# EAGLE design Arduio_matrix-shield_02 (EAGLE 6.6.0)
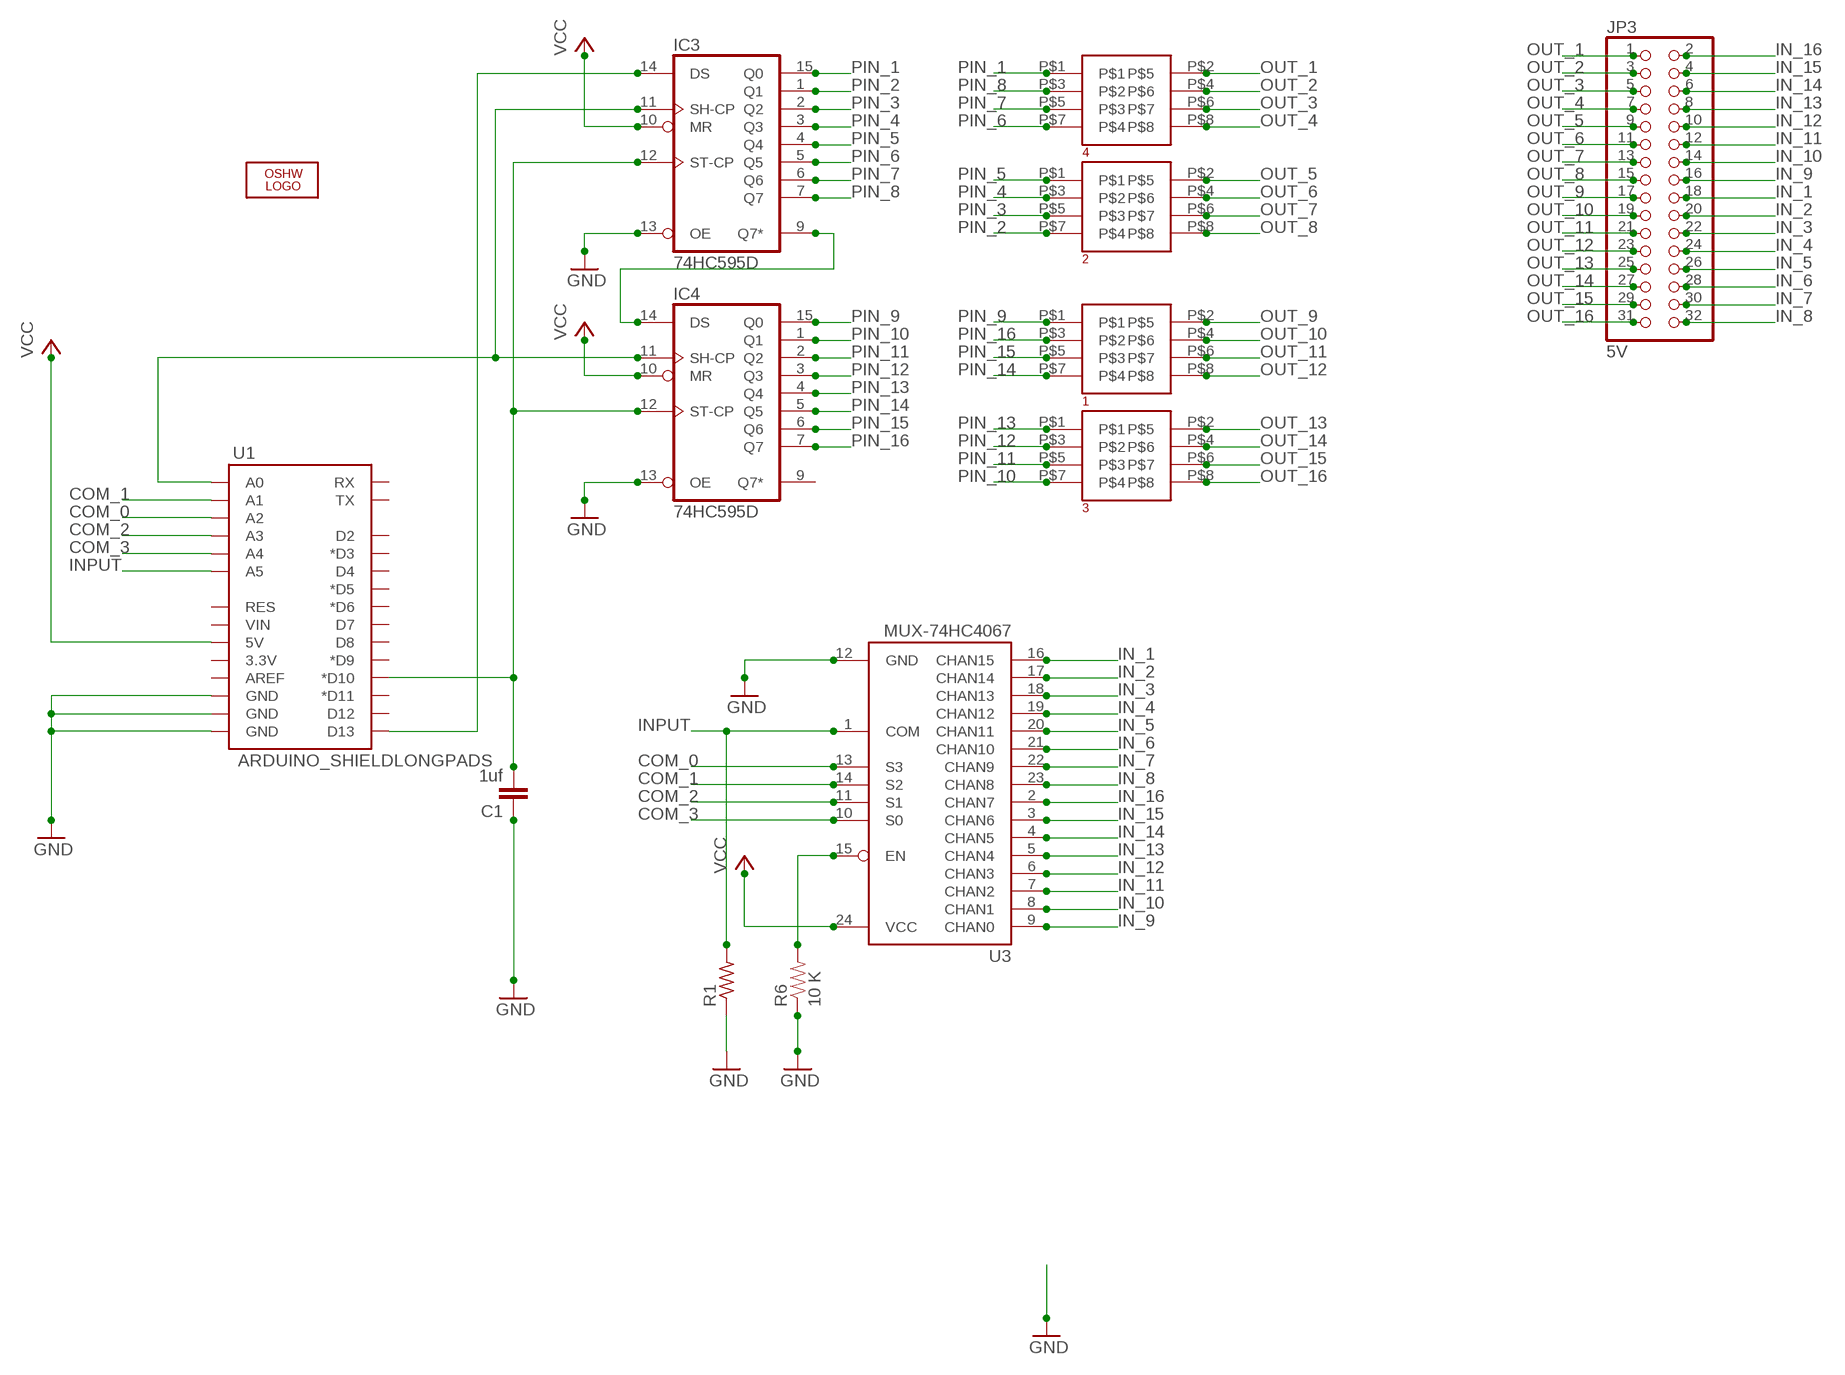
[diagram p0: schematic, sheet 1]

## Parts
1  D83A  [D83A]
2  D83A  [D83A]
3  D83A  [D83A]
4  D83A  [D83A]
C1  1uf  2.2UF-CERCAP-10009  [1206]
IC3  74HC595D  [SO16]
IC4  74HC595D  [SO16]
JP3  5V  PINHD-2X16/90  [2X16/90]
OSHW  OSHW_LOGO_8MILX0350-NT  [OSHW_8X350_NOTEXT]
R1  R-US_0204/7  [0204/7]
R6  10 K  RESISTOR1206  [1206]
U1  ARDUINO_SHIELDLONGPADS  [DUEMILANOVE_SHIELD_LONGPADS]
U3  MUX-74HC4067  MUX-74HC4067SMD  [SSOP24]

## Nets
COM_0: U1.A2 U3.13(S3)
COM_1: U1.A1 U3.14(S2)
COM_2: U1.A3 U3.11(S1)
COM_3: U1.A4 U3.10(S0)
GND [gnd_plane]: C1.1 IC3.13(OE) IC4.13(OE) R1.1 R6.1 U1.GND@0(GND) U1.GND@1(GND) U1.GND@2(GND) U3.12(GND)
IN_1: JP3.18 U3.16(CHAN15)
IN_2: JP3.20 U3.17(CHAN14)
IN_3: JP3.22 U3.18(CHAN13)
IN_4: JP3.24 U3.19(CHAN12)
IN_5: JP3.26 U3.20(CHAN11)
IN_6: JP3.28 U3.21(CHAN10)
IN_7: JP3.30 U3.22(CHAN9)
IN_8: JP3.32 U3.23(CHAN8)
IN_9: JP3.16 U3.9(CHAN0)
IN_10: JP3.14 U3.8(CHAN1)
IN_11: JP3.12 U3.7(CHAN2)
IN_12: JP3.10 U3.6(CHAN3)
IN_13: JP3.8 U3.5(CHAN4)
IN_14: JP3.6 U3.4(CHAN5)
IN_15: JP3.4 U3.3(CHAN6)
IN_16: JP3.2 U3.2(CHAN7)
INPUT: R1.2 U1.A5 U3.1(COM)
N$1: IC3.9(Q7*) IC4.14(DS)
N$2: R6.2 U3.15(EN)
N$3: IC3.11(SH-CP) IC4.11(SH-CP) U1.A0
N$4: C1.2 IC3.12(ST-CP) IC4.12(ST-CP) U1.D10(*D10)
N$8: IC3.14(DS) U1.D13
OUT_1: 4.P$2 JP3.1
OUT_2: 4.P$4 JP3.3
OUT_3: 4.P$6 JP3.5
OUT_4: 4.P$8 JP3.7
OUT_5: 2.P$2 JP3.9
OUT_6: 2.P$4 JP3.11
OUT_7: 2.P$6 JP3.13
OUT_8: 2.P$8 JP3.15
OUT_9: 1.P$2 JP3.17
OUT_10: 1.P$4 JP3.19
OUT_11: 1.P$6 JP3.21
OUT_12: 1.P$8 JP3.23
OUT_13: 3.P$2 JP3.25
OUT_14: 3.P$4 JP3.27
OUT_15: 3.P$6 JP3.29
OUT_16: 3.P$8 JP3.31
PIN_1: 4.P$1 IC3.15(Q0)
PIN_2: 2.P$7 IC3.1(Q1)
PIN_3: 2.P$5 IC3.2(Q2)
PIN_4: 2.P$3 IC3.3(Q3)
PIN_5: 2.P$1 IC3.4(Q4)
PIN_6: 4.P$7 IC3.5(Q5)
PIN_7: 4.P$5 IC3.6(Q6)
PIN_8: 4.P$3 IC3.7(Q7)
PIN_9: 1.P$1 IC4.15(Q0)
PIN_10: 3.P$7 IC4.1(Q1)
PIN_11: 3.P$5 IC4.2(Q2)
PIN_12: 3.P$3 IC4.3(Q3)
PIN_13: 3.P$1 IC4.4(Q4)
PIN_14: 1.P$7 IC4.5(Q5)
PIN_15: 1.P$5 IC4.6(Q6)
PIN_16: 1.P$3 IC4.7(Q7)
VCC: IC3.10(MR) IC4.10(MR) U1.5V U3.24(VCC)
Unconnected: IC4.9(Q7*) U1.3.3V U1.AREF U1.D2 U1.D3(*D3) U1.D4 U1.D5(*D5) U1.D6(*D6) U1.D7 U1.D8 U1.D9(*D9) U1.D11(*D11) U1.D12 U1.RES U1.RX U1.TX U1.VIN

## Power pins joined to a net without a drawn wire
GND: IC3.8(GND) IC4.8(GND)
VCC: IC3.16(VCC) IC4.16(VCC)

## Library data of the parts
1-4 = diodes_array:D83A
C1 = SparkFun-Capacitors:2.2UF-CER: 2.2uF Ceramic SMT CAP-07888- 10V, 20% (0603) CAP-10009- 50V, 10% (1206); PROD_ID: CAP-10009; VALUE: 2.2uF
IC3 IC4 = 74xx-eu:74*595: 8-bit SHIFT REGISTER, output latch
JP3 = pinhead:PINHD-2X16: PIN HEADER
OSHW = ohw-logo:OSHW_LOGO_8MIL
R1 = rcl:R-US_: RESISTOR, American symbol
R6 = spark-fun:RESISTOR: Resistor Basic schematic elements and footprints for 0603, 1206, and PTH 1/10th watt (small) resistors.
U1 = SparkFun-Boards:ARDUINO_SHIELD: Arduino shield footprint
U3 = SparkFun:MUX-74HC4067

## Net classes
0 default: width 0.24 mm, drill 0.8 mm, clearance 0.432 mm
2 gnd_plane: width 1 mm, drill 0.8 mm, clearance 0.356 mm
3 vcc: width 1 mm, drill 0.8 mm, clearance 0.356 mm
4 VDD: width 1 mm, clearance 0.381 mm

## Board
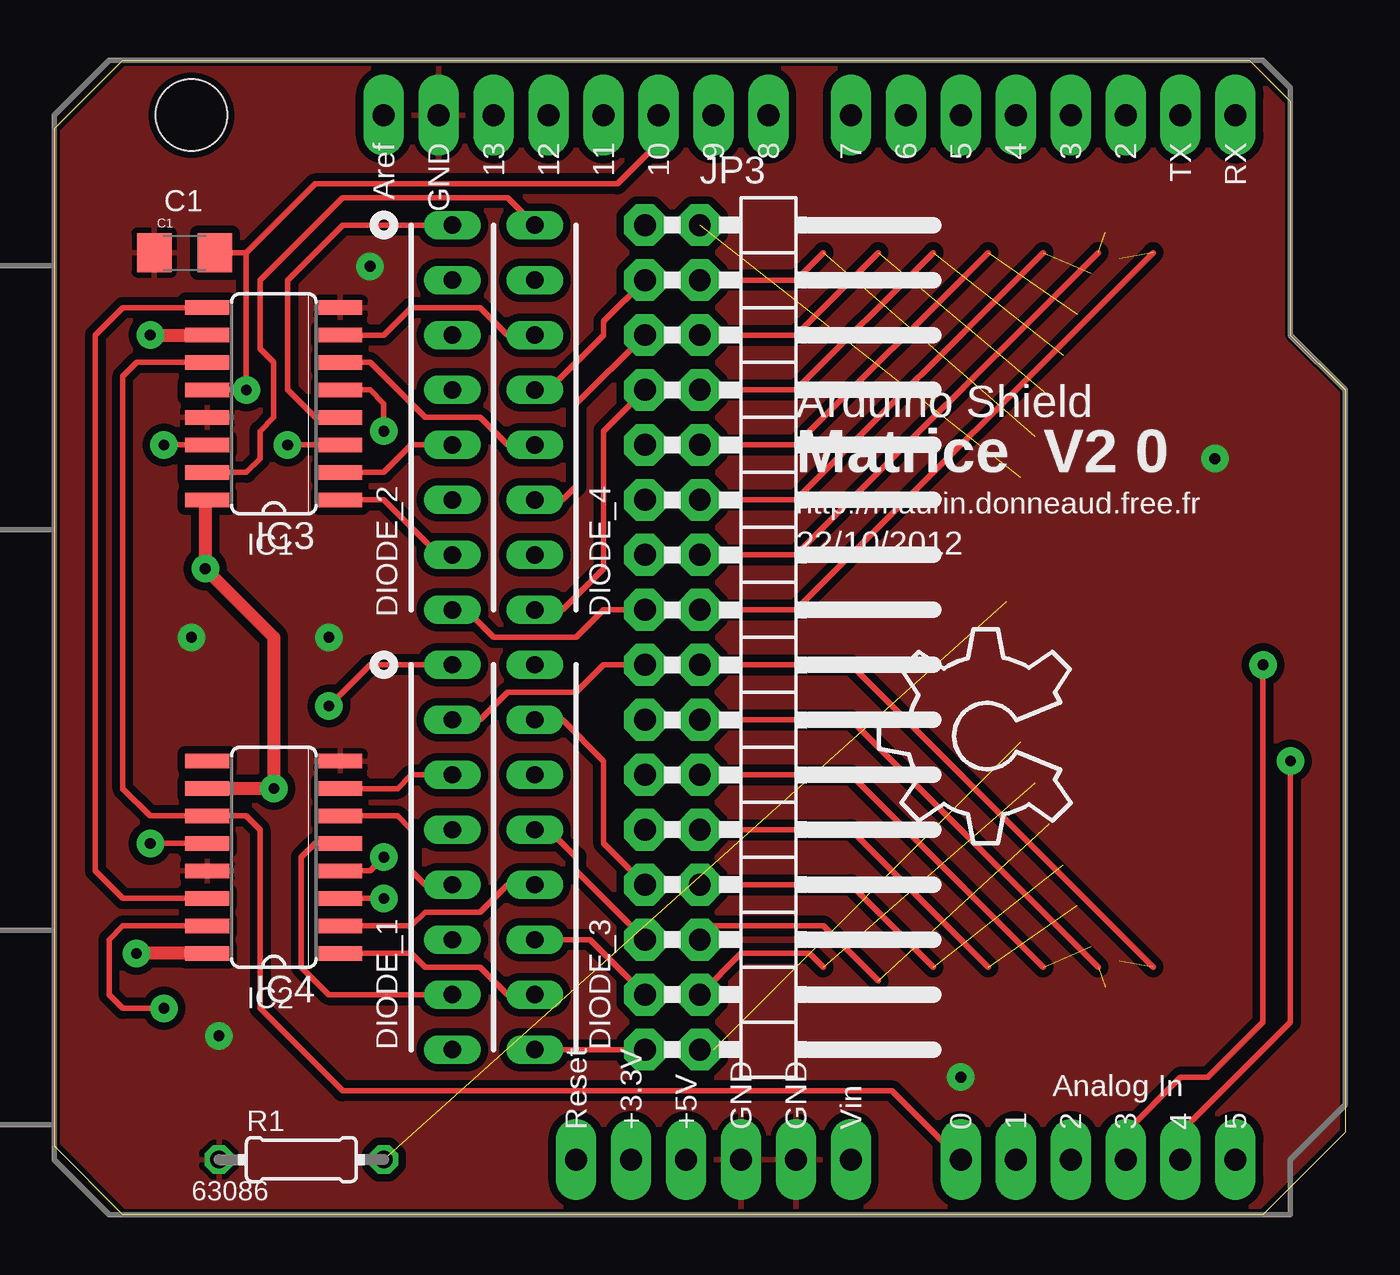
[diagram p1: board, top side]
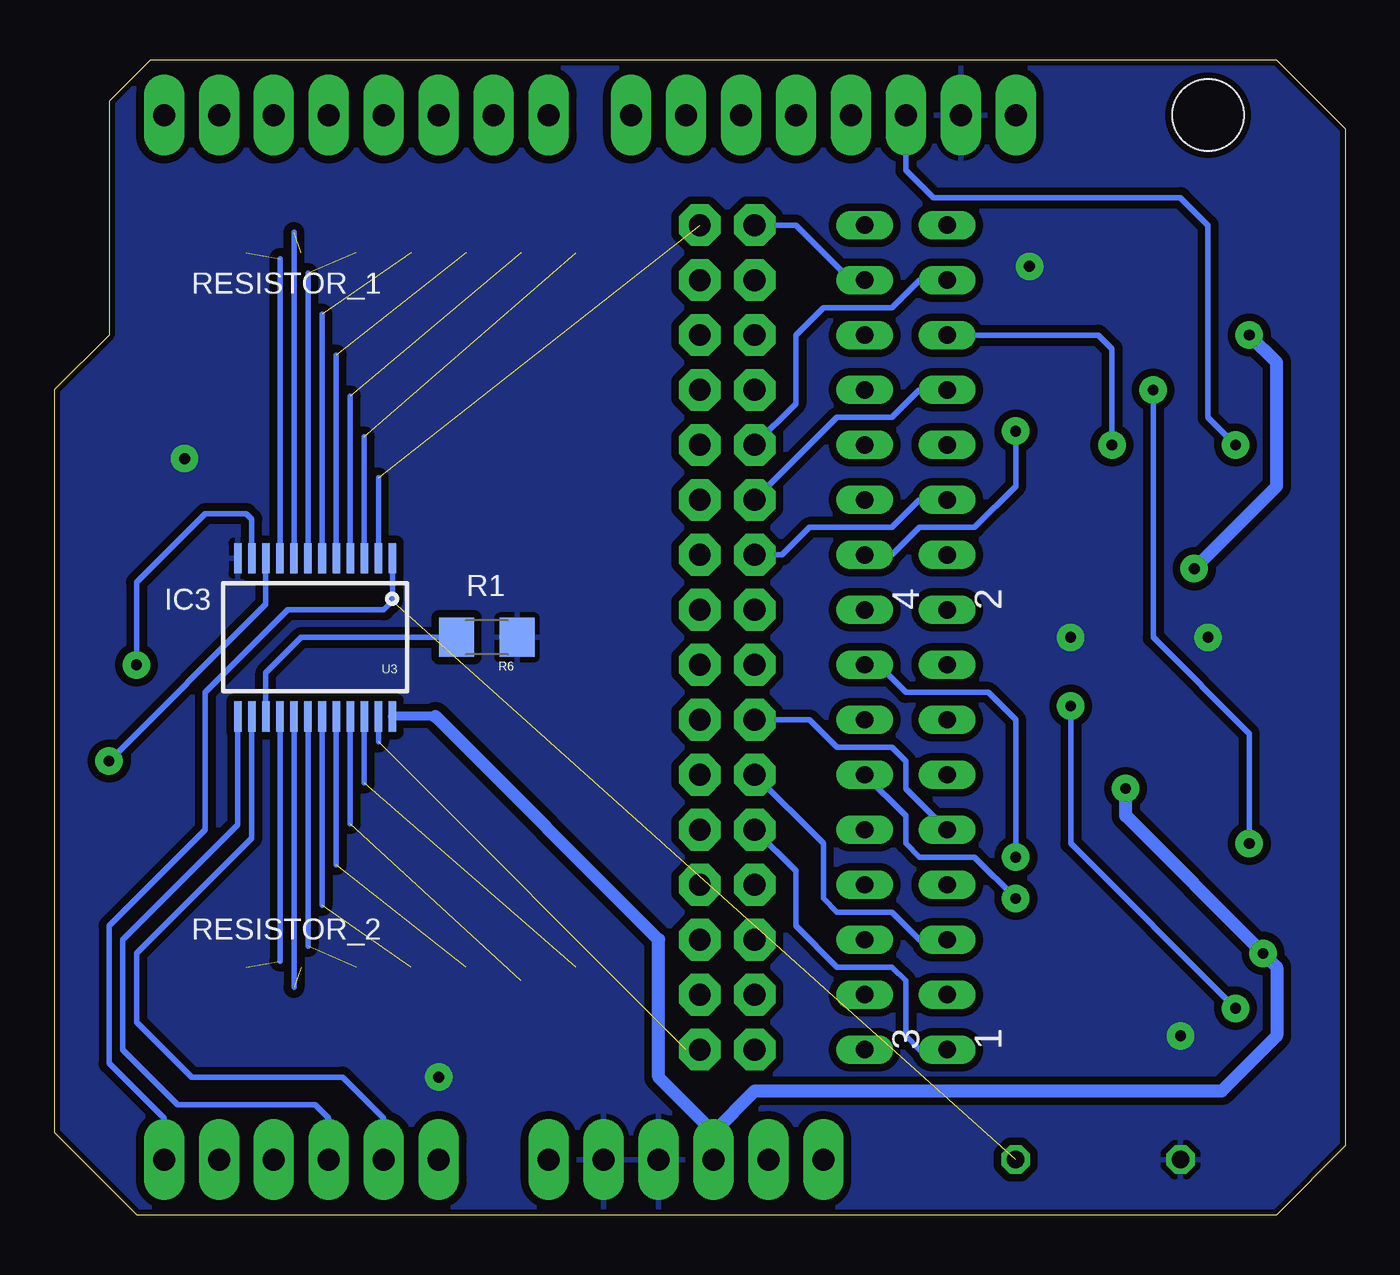
[diagram p2: board, bottom side, seen from below]

Size 59.69 x 53.34 mm. Coordinates in mm from the lower left corner, seen from the top.
Outline: 0,50.16 0,3.17 3.17,0 55.88,0 59.69,3.81 59.69,38.1 57.15,40.64 57.15,51.44 55.24,53.34 3.17,53.34 0,50.16
Copper layers (1*16): Top 0.035mm / dielectric 1.5mm / Bottom 0.035mm
Design rules "default": minimum track width 6mil, minimum drill 12mil, track to track 6mil, track to pad 6mil, pad to pad 6mil, via to via 6mil, smd to smd 0mil, copper to edge 10mil, drill to drill 10mil, minimum pad ring 10mil, minimum via ring 6mil, stop-mask expansion 2mil, vias tented up to drill 100mil, thermal gap 10mil

### Footprints (pad centres in the part's own frame; a part is rotated, then mirrored left to right if it is on the bottom)
D83A = drill 0.8 long: P$1 0,5.08; P$2 0,2.54; P$3 0,0; P$4 0,-2.54; P$5 0,-5.08; P$6 0,-7.62; P$7 0,-10.16; P$8 0,-12.7
1206 = smd 1.6 x 1.8: 1 -1.4,0; 2 1.4,0
SO16 = smd 0.66 x 2.032: 1 -4.445,-3.073; 2 -3.175,-3.073; 3 -1.905,-3.073; 4 -0.635,-3.073; 5 0.635,-3.073; 6 1.905,-3.073; 7 3.175,-3.073; 8 4.445,-3.073; 9 4.445,3.073; 10 3.175,3.073; 11 1.905,3.073; 12 0.635,3.073; 13 -0.635,3.073; 14 -1.905,3.073; 15 -3.175,3.073; 16 -4.445,3.073
2X16/90 = drill 1.016 pad 1.93 octagon: 1 -19.05,-6.35; 2 -19.05,-3.81; 3 -16.51,-6.35; 4 -16.51,-3.81; 5 -13.97,-6.35; 6 -13.97,-3.81; 7 -11.43,-6.35; 8 -11.43,-3.81; 9 -8.89,-6.35; 10 -8.89,-3.81; 11 -6.35,-6.35; 12 -6.35,-3.81; 13 -3.81,-6.35; 14 -3.81,-3.81; 15 -1.27,-6.35; 16 -1.27,-3.81; 17 1.27,-6.35; 18 1.27,-3.81; 19 3.81,-6.35; 20 3.81,-3.81; 21 6.35,-6.35; 22 6.35,-3.81; 23 8.89,-6.35; 24 8.89,-3.81; 25 11.43,-6.35; 26 11.43,-3.81; 27 13.97,-6.35; 28 13.97,-3.81; 29 16.51,-6.35; 30 16.51,-3.81; 31 19.05,-6.35; 32 19.05,-3.81
0204/7 = drill 0.813 octagon: 1 -3.81,0; 2 3.81,0
DUEMILANOVE_SHIELD_LONGPADS = drill 1.016 pad 1.88 long: 3.3V 50.8,26.67; 5V 50.8,29.21; A0 50.8,41.91; A1 50.8,44.45; A2 50.8,46.99; A3 50.8,49.53; A4 50.8,52.07; A5 50.8,54.61; AREF 2.54,15.24; D2 2.54,49.53; D3 2.54,46.99; D4 2.54,44.45; D5 2.54,41.91; D6 2.54,39.37; D7 2.54,36.83; D8 2.54,33.02; D9 2.54,30.48; D10 2.54,27.94; D11 2.54,25.4; D12 2.54,22.86; D13 2.54,20.32; GND@0 50.8,31.75; GND@1 50.8,34.29; GND@2 2.54,17.78; RES 50.8,24.13; RX 2.54,54.61; TX 2.54,52.07; VIN 50.8,36.83 | hole 3.302: 2.54,6.35
SSOP24 = smd 0.348 x 1.397: 1 -3.575,-3.656; 2 -2.925,-3.656; 3 -2.275,-3.656; 4 -1.625,-3.656; 5 -0.975,-3.656; 6 -0.325,-3.656; 7 0.325,-3.656; 8 0.975,-3.656; 9 1.625,-3.656; 10 2.275,-3.656; 11 2.925,-3.656; 12 3.575,-3.656; 13 3.575,3.656; 14 2.925,3.656; 15 2.275,3.656; 16 1.625,3.656; 17 0.975,3.656; 18 0.325,3.656; 19 -0.325,3.656; 20 -0.975,3.656; 21 -1.625,3.656; 22 -2.275,3.656; 23 -2.925,3.656; 24 -3.575,3.656

### Placement (x,y rotation side)
1  18.41,20.32 0 bottom
2  18.41,40.64 0 bottom
3  22.23,20.32 0 bottom
4  22.23,40.64 0 bottom
C1  6.03,44.45 0 top
IC3  10.16,37.47 90 top
IC4  10.16,16.51 90 top
JP3  33.66,26.67 270 top
OSHW  46.99,17.14 90 top
R1  11.43,2.54 0 top
R6  39.69,26.67 180 bottom
U1  0,53.34 270 top
U3  47.62,26.67 180 bottom

### Tracks (layer width: path | path; a pad name or v marks a point on that pad's centre or on a via)
COM_0
  Bottom 0.254: U3.13 51.2,18.02 56.52,12.7 56.52,7.62 53.98,5.08 47.62,5.08 46.99,4.45 U1.A2
COM_1
  Bottom 0.254: U3.14 50.55,17.39 55.88,12.06 55.88,8.89 53.34,6.35 46.35,6.35 44.45,4.45 U1.A1
COM_2  (via drill 0.5 pad 1.27)
  Top 0.254: v55.88,25.4 55.88,8.89 53.34,6.35 52.07,6.35 49.53,3.81 U1.A3
  Bottom 0.254: U3.11 50.55,32.13 50.8,32.38 52.7,32.38 55.88,29.21 v55.88,25.4
COM_3  (via drill 0.5 pad 1.27)
  Top 0.254: v57.15,20.95 57.15,8.89 52.07,3.81 U1.A4
  Bottom 0.254: U3.10 49.9,28.2 v57.15,20.95
GND  (via drill 0.5 pad 1.27)
  other vias: 14.61,43.81 12.7,26.67 6.35,26.67 7.62,8.26 53.66,34.92 41.91,6.35
  pour Bottom: 55.24,53.34 3.17,53.34 0,50.16 0,3.17 3.17,0 55.88,0 59.69,3.81 59.69,38.1 57.15,40.64 57.15,51.44
  pour Top: 0,50.16 0,3.17 3.17,0 55.88,0 59.69,3.81 59.69,38.1 57.15,40.64 57.15,51.44 55.24,53.34 3.17,53.34
IN_1  (1 unrouted)
  Top 0.254: JP3.18 36.83,25.4 50.8,11.43
  Bottom 0.254: U3.16 49.25,11.71
IN_2  (1 unrouted)
  Top 0.254: JP3.20 36.83,22.86 48.26,11.43
  Bottom 0.254: U3.17 48.6,10.5
IN_3  (1 unrouted)
  Top 0.254: JP3.22 36.83,20.32 45.72,11.43
  Bottom 0.254: U3.18 47.95,12.39
IN_4  (1 unrouted)
  Top 0.254: JP3.24 36.83,17.78 43.18,11.43
  Bottom 0.254: U3.19 47.3,14.28
IN_5  (1 unrouted)
  Top 0.254: JP3.26 36.83,15.24 40.64,11.43
  Bottom 0.254: U3.20 46.65,16.17
IN_6  (1 unrouted)
  Top 0.254: JP3.28 30.48,13.34 35.56,13.34 38.1,10.79
  Bottom 0.254: U3.21 46,18.06
IN_7  (1 unrouted)
  Top 0.254: JP3.30 31.75,12.06 34.92,12.06 35.56,11.43
  Bottom 0.254: U3.22 45.35,19.95
IN_8  (1 unrouted)
  Top 0.254: JP3.32 30.48,7.62
  Bottom 0.254: U3.23 44.7,21.84
IN_9  (1 unrouted)
  Top 0.254: JP3.16 34.29,27.94 50.8,44.45
  Bottom 0.254: U3.9 49.25,44.17
IN_10  (1 unrouted)
  Top 0.254: JP3.14 34.29,30.48 48.26,44.45
  Bottom 0.254: U3.8 48.6,45.38
IN_11  (1 unrouted)
  Top 0.254: JP3.12 34.29,33.02 45.72,44.45
  Bottom 0.254: U3.7 47.95,43.49
IN_12  (1 unrouted)
  Top 0.254: JP3.10 34.29,35.56 43.18,44.45
  Bottom 0.254: U3.6 47.3,41.6
IN_13  (1 unrouted)
  Top 0.254: JP3.8 34.29,38.1 40.64,44.45
  Bottom 0.254: U3.5 46.65,39.71
IN_14  (1 unrouted)
  Top 0.254: JP3.6 34.29,40.64 38.1,44.45
  Bottom 0.254: U3.4 46,37.82
IN_15  (1 unrouted)
  Top 0.254: 35.56,44.45 34.29,43.18 JP3.4
  Bottom 0.254: U3.3 45.35,35.93
IN_16  (1 unrouted)
  Bottom 0.254: U3.2 44.7,34.04
INPUT  (1 unrouted)
  Bottom 0.254: U3.1 44.05,28.34 44.45,27.94 48.9,27.94 52.7,24.13 52.7,17.78 57.15,13.34 57.15,6.99 54.61,4.45 U1.A5
N$1
  Top 0.254: IC3.9 3.17,41.91 1.91,40.64 1.91,15.88 3.17,14.61 IC4.14
N$2
  Bottom 0.254: U3.15 49.9,25.03 48.26,26.67 R6.2
N$3
  Top 0.254: IC3.11 3.81,39.37 3.17,38.73 3.17,19.68 4.45,18.41 IC4.11 8.89,18.41 9.53,17.78 9.53,9.53 13.34,5.71 38.73,5.71 U1.A0
N$4  (via drill 0.5 pad 1.27)
  Top 0.254: U1.D10 27.94,49.53 26.04,47.62 12.06,47.62 8.89,44.45 | IC3.12 v8.89,38.1 8.89,44.45 | C1.2 8.89,44.45 | IC4.12 v4.45,17.14
  Bottom 0.254: v4.45,17.14 4.45,22.23 8.89,26.67 v8.89,38.1
N$8  (via drill 0.5 pad 1.27)
  Top 0.254: v5.08,35.56 IC3.14
  Bottom 0.254: U1.D13 20.32,48.26 19.05,46.99 7.62,46.99 6.35,45.72 6.35,36.83 v5.08,35.56
OUT_1
  Bottom 0.254: 4.P$2 22.86,43.18 25.4,45.72 JP3.1
OUT_2
  Top 0.254: JP3.3 25.4,41.27 25.4,40.64 22.86,38.1 4.P$4
OUT_3
  Top 0.254: JP3.5 24.13,37.47 24.13,33.66 23.5,33.02 4.P$6
OUT_4
  Top 0.254: JP3.7 25.4,36.2 25.4,29.84 23.5,27.94 4.P$8
OUT_5
  Bottom 0.254: 2.P$2 19.68,43.18 20.95,41.91 24.13,41.91 25.4,40.64 25.4,37.47 JP3.9
OUT_6
  Bottom 0.254: JP3.11 23.5,36.83 20.95,36.83 19.68,38.1 2.P$4
OUT_7
  Bottom 0.254: JP3.13 26.04,30.48 24.77,31.75 20.95,31.75 19.68,33.02 2.P$6
OUT_8
  Top 0.254: 2.P$8 19.05,27.94 20.32,26.67 24.13,26.67 25.4,27.94 JP3.15
OUT_9
  Top 0.254: JP3.17 25.4,25.4 24.13,24.13 20.95,24.13 19.68,22.86 1.P$2
OUT_10
  Bottom 0.254: JP3.19 24.77,22.86 23.5,21.59 20.95,21.59 20.32,20.95 20.32,19.68 1.P$4
OUT_11
  Bottom 0.254: JP3.21 24.13,17.14 24.13,14.61 23.5,13.97 20.95,13.97 19.68,12.7 1.P$6
OUT_12
  Bottom 0.254: JP3.23 25.4,15.88 25.4,13.34 23.5,11.43 20.95,11.43 20.32,10.79 20.32,8.26 19.68,7.62 1.P$8
OUT_13
  Top 0.254: 3.P$2 23.5,22.86 25.4,20.95 25.4,17.14 JP3.25
OUT_14
  Top 0.254: 3.P$4 22.86,17.78 24.13,16.51 24.13,15.88 JP3.27
OUT_15
  Top 0.254: JP3.29 24.77,12.7 3.P$6
OUT_16
  Top 0.254: 3.P$8 JP3.31
PIN_1
  Top 0.254: 4.P$1 20.95,46.99 13.34,46.99 9.53,43.18 9.53,40.01 10.16,39.37 10.16,36.83 9.53,36.2 9.53,34.92 8.89,34.29 IC3.15 6.99,34.29
PIN_2
  Top 0.254: IC3.1 15.24,33.02 17.78,30.48 2.P$7
PIN_3
  Top 0.254: IC3.2 15.24,34.29 16.51,35.56 2.P$5
PIN_4  (via drill 0.5 pad 1.27)
  Top 0.254: v10.79,35.56 IC3.3
  Bottom 0.254: 2.P$3 11.43,40.64 10.79,40.01 v10.79,35.56
PIN_5
  Top 0.254: 2.P$1 13.34,45.72 10.79,43.18 10.79,38.1 12.06,36.83 IC3.4
PIN_6  (via drill 0.5 pad 1.27)
  Top 0.254: v15.24,36.2 15.24,37.47 14.61,38.1 IC3.5
  Bottom 0.254: v15.24,36.2 15.24,33.66 17.14,31.75 19.68,31.75 20.95,30.48 4.P$7
PIN_7
  Top 0.254: IC3.6 14.61,39.37 17.14,36.83 19.68,36.83 20.95,35.56 4.P$5
PIN_8
  Top 0.254: 4.P$3 20.95,40.64 19.68,41.91 16.51,41.91 15.24,40.64 IC3.7
PIN_9  (via drill 0.5 pad 1.27)
  Top 0.254: 1.P$1 14.61,25.4 v12.7,23.5 | v5.08,9.53 3.17,9.53 2.54,10.16 2.54,12.7 3.17,13.34 IC4.15
  Bottom 0.254: v12.7,23.5 12.7,17.14 v5.08,9.53
PIN_10
  Top 0.254: IC4.1 16.51,12.06 17.14,11.43 19.68,11.43 20.95,10.16 3.P$7
PIN_11
  Top 0.254: IC4.2 16.51,13.34 17.14,13.97 19.68,13.97 20.95,15.24 3.P$5
PIN_12  (via drill 0.5 pad 1.27)
  Top 0.254: v15.24,14.61 IC4.3
  Bottom 0.254: 3.P$3 20.32,18.41 20.32,17.14 19.68,16.51 17.14,16.51 v15.24,14.61
PIN_13  (via drill 0.5 pad 1.27)
  Top 0.254: IC4.4 14.61,15.88 v15.24,16.51
  Bottom 0.254: v15.24,16.51 15.24,22.86 16.51,24.13 20.32,24.13 21.59,25.4 3.P$1
PIN_14
  Top 0.254: IC4.5 12.06,17.14 11.43,16.51 11.43,11.43 12.7,10.16 1.P$7
PIN_15
  Top 0.254: 1.P$5 17.14,15.24 16.51,15.88 16.51,17.78 15.88,18.41 IC4.6
PIN_16
  Top 0.254: IC4.7 15.88,19.68 16.51,20.32 1.P$3
VCC  (via drill 0.5 pad 1.27)
  Top 0.61: IC4.16 v3.81,12.06 | IC4.10 v10.16,19.68 10.16,26.67 v6.99,29.84 6.99,33.02 IC3.16 | v4.45,40.64 IC3.10
  Bottom 0.406: 42.06,23.01 U3.24
  Bottom 0.61: U1.5V 29.21,3.81 | 29.21,3.81 27.3,5.71 5.71,5.71 3.17,8.26 3.17,11.43 v3.81,12.06 10.16,18.41 v10.16,19.68 | v6.99,29.84 3.17,33.66 3.17,39.37 v4.45,40.64 | 29.21,3.81 31.75,6.35 31.75,12.7 42.06,23.01

### Text on the board
_tsilk: C1 | Arduino Shield | Matrice V2 0 | http://maurin.donneaud.free.fr | IC1 | 22/10/2012 | DIODE_2 | DIODE_4 | IC2 | DIODE_1 | DIODE_3 | 63086
_bsilk: RESISTOR_1 | R1 | IC3 | RESISTOR_2